# Altium schematic sheet Buck_Regulator.SchDoc
size A4; SheetNumber: 3; SheetTotal: 4
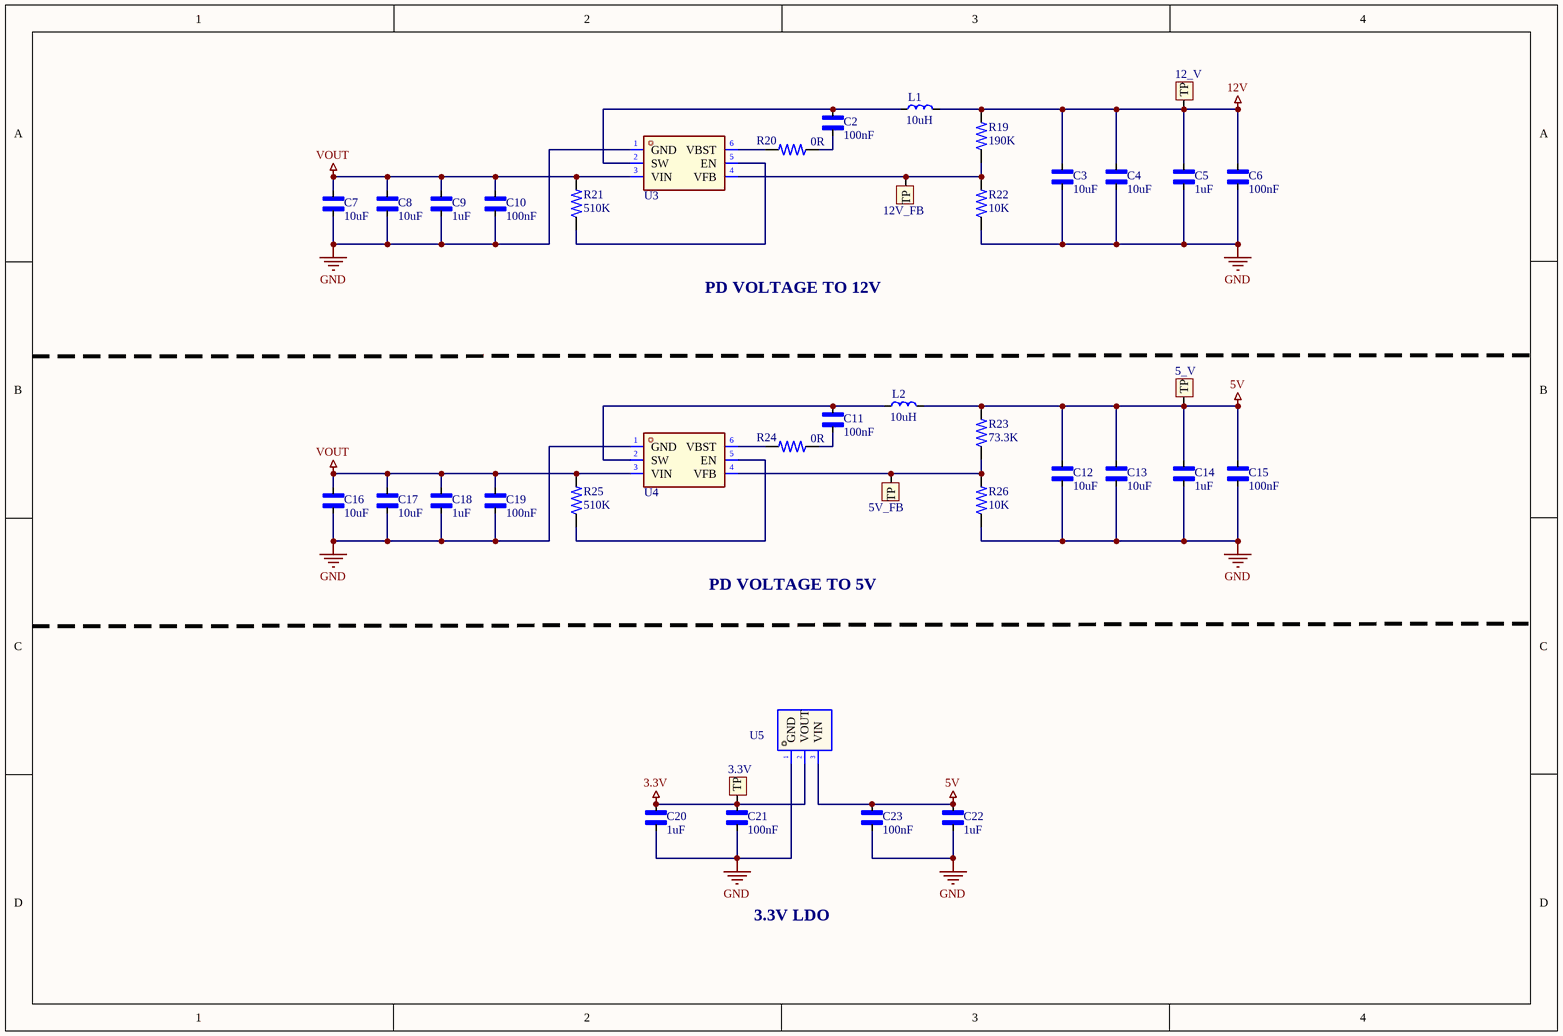
[diagram p0: Buck_Regulator.SchDoc]

## Parts
3.3V  TEST POINT  [TESTPOINT]  (value not drawn)
5_V  TEST POINT  [TESTPOINT]  (value not drawn)
5V_FB  TEST POINT  [TESTPOINT]  (value not drawn)
12_V  TEST POINT  [TESTPOINT]  (value not drawn)
12V_FB  TEST POINT  [TESTPOINT]  (value not drawn)
C2  value 100nF  [CAP 0402]  (hidden comment: SMD capacitor)
C3  value 10uF  [CAP_0805]  (hidden comment: SMD capacitor)
C4  value 10uF  [CAP_0805]  (hidden comment: SMD capacitor)
C5  value 1uF  [CAP 0402]  (hidden comment: SMD capacitor)
C6  value 100nF  [CAP 0402]  (hidden comment: SMD capacitor)
C7  value 10uF  [CAP_0805]  (hidden comment: SMD capacitor)
C8  value 10uF  [CAP_0805]  (hidden comment: SMD capacitor)
C9  value 1uF  [CAP 0402]  (hidden comment: SMD capacitor)
C10  value 100nF  [CAP 0402]  (hidden comment: SMD capacitor)
C11  value 100nF  [CAP 0402]  (hidden comment: SMD capacitor)
C12  value 10uF  [CAP_0805]  (hidden comment: SMD capacitor)
C13  value 10uF  [CAP_0805]  (hidden comment: SMD capacitor)
C14  value 1uF  [CAP 0402]  (hidden comment: SMD capacitor)
C15  value 100nF  [CAP 0402]  (hidden comment: SMD capacitor)
C16  value 10uF  [CAP_0805]  (hidden comment: SMD capacitor)
C17  value 10uF  [CAP_0805]  (hidden comment: SMD capacitor)
C18  value 1uF  [CAP 0402]  (hidden comment: SMD capacitor)
C19  value 100nF  [CAP 0402]  (hidden comment: SMD capacitor)
C20  value 1uF  [CAP 0402]  (hidden comment: SMD capacitor)
C21  value 100nF  [CAP 0402]  (hidden comment: SMD capacitor)
C22  value 1uF  [CAP 0402]  (hidden comment: SMD capacitor)
C23  value 100nF  [CAP 0402]  (hidden comment: SMD capacitor)
L1  value 10uH  [INDP7166X50N]  (hidden comment: POWER INDUCTOR)
L2  value 10uH  [INDP7166X50N]  (hidden comment: POWER INDUCTOR)
R19  value 190K  [RES 0402]  (hidden comment: SMD resistor)
R20  value 0R  [RES 0402]  (hidden comment: SMD resistor)
R21  value 510K  [RES 0402]  (hidden comment: SMD resistor)
R22  value 10K  [RES 0402]  (hidden comment: SMD resistor)
R23  value 73.3K  [RES 0402]  (hidden comment: SMD resistor)
R24  value 0R  [RES 0402]  (hidden comment: SMD resistor)
R25  value 510K  [RES 0402]  (hidden comment: SMD resistor)
R26  value 10K  [RES 0402]  (hidden comment: SMD resistor)
U3  Buck IC  [SOT-23-6_L2.9-W1.6-P0.95-LS2.8-BR]  (value not drawn)
U4  Buck IC  [SOT-23-6_L2.9-W1.6-P0.95-LS2.8-BR]  (value not drawn)
U5  3.3V LDO  [SOT-89-3_L4.5-W2.5-P1.50-LS4.1-BR]  (value not drawn)

## Nets
3.3V: 3.3V.1(TP) C20.1 C21.1 U5.2(VOUT)
5V: 5_V.1(TP) C12.1 C13.1 C14.1 C15.1 C22.1 C23.1 L2.2 R23.2 U5.3(VIN)
12V: 12_V.1(TP) C3.1 C4.1 C5.1 C6.1 L1.2 R19.2
GND: C3.2 C4.2 C5.2 C6.2 C7.2 C8.2 C9.2 C10.2 C12.2 C13.2 C14.2 C15.2 C16.2 C17.2 C18.2 C19.2 C20.2 C21.2 C22.2 C23.2 R22.1 R26.1 U3.1(GND) U4.1(GND) U5.1(GND)
VOUT: C7.1 C8.1 C9.1 C10.1 C16.1 C17.1 C18.1 C19.1 R21.2 R25.2 U3.3(VIN) U4.3(VIN)
Net5V_FB_1: 5V_FB.1(TP) R23.1 R26.2 U4.4(VFB)
Net12V_FB_1: 12V_FB.1(TP) R19.1 R22.2 U3.4(VFB)
NetC2_1: C2.1 L1.1 U3.2(SW)
NetC2_2: C2.2 R20.1
NetC11_1: C11.1 L2.1 U4.2(SW)
NetC11_2: C11.2 R24.1
NetR20_2: R20.2 U3.6(VBST)
NetR21_1: R21.1 U3.5(EN)
NetR24_2: R24.2 U4.6(VBST)
NetR25_1: R25.1 U4.5(EN)

## Notes on the sheet
- PD VOLTAGE TO 12V
- PD VOLTAGE TO 5V
- 3.3V LDO

## Library data of the parts
C2-C23 = CAP_SMD_CERAMIC: Voltage: 50V; Tolerance: ±10%; Price: *; JLCPCB Part #: *
  C2 C5 C6 C9-C11 C14 C15 C18-C23: Package: 0603
  C3 C4 C7 C8 C12 C13 C16 C17: Package: 0805
L1 L2 = PSPMAA0605H-100M-ANP: FIXED IND 10uH 4.5A 57mΩ SMD,6.6x7.1mm; Manifacturing Company Name: PROD Tech; Manifacturing Part Number: PSPMAA0605H-100M-ANP; Data Sheet: https://www.lcsc.com/datasheet/C2983092.pdf; Package: SMD,6.6x7.1mm; Price: *
R19-R26 = RES_SMD_CERAMIC: Tolerance: ±5%; Package: 0402; Price: *; JLCPCB Part #: *
U3 U4 = TPP363080-T6TR: Buck Adjustable 4.5V~36V 3A TSOT-23-6 DC-DC Converters ROHS; Manifacturing Company Name: 3PEAK; Manifacturing Part Number: TPP363080-T6TR; Data Sheet: https://www.lcsc.com/datasheet/C18236275.pdf; Package: TSOT-23-6; Price: *; Tolerance: N/A; JLCPCB Part #: C18236275
U5 = AMS1117S-3.3: 70dB@(120Hz) 1A Fixed 3.3V Positive 30V SOT-89-3 Voltage Regulators - Linear, Low Drop Out (LDO) Regulators ROHS; Manifacturing Company Name: JSMSEMI; Manifacturing Part Number: AMS1117S-3.3; Data Sheet: https://www.lcsc.com/datasheet/C917152.pdf; Package: SOT-89-3; Price: *; Tolerance: N/A; JLCPCB Part #: JSMSEMI; Value: *